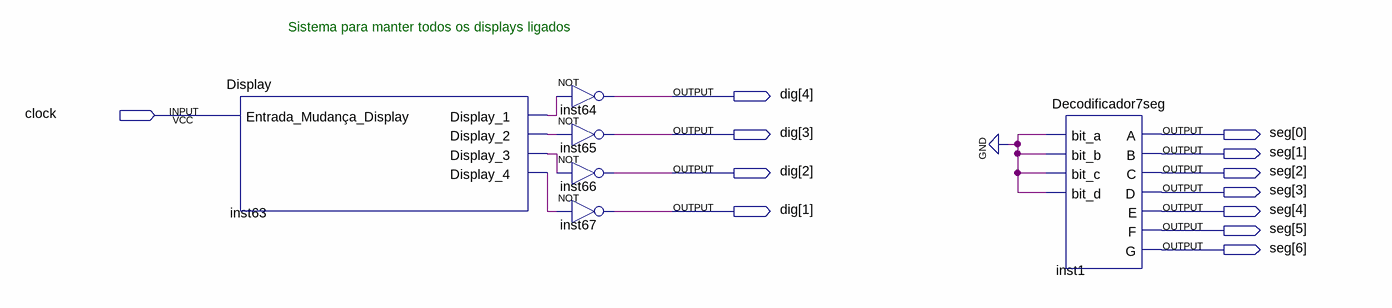
[diagram p0: schematic sheet]
// Quartus schematic Ligar4Displays.bdf as structural Verilog: 6 symbols, 12 pins
module Ligar4Displays (
  input  clock,
  output [4:1] dig,
  output [6:0] seg
);

  wire inst63_display_1, inst63_display_2, inst63_display_3, inst63_display_4;

  Display inst63 (
    .\Entrada_Mudança_Display (clock), .Display_1(inst63_display_1), .Display_2(inst63_display_2),
    .Display_3(inst63_display_3), .Display_4(inst63_display_4));
  not inst64 (dig[4], inst63_display_1);
  not inst65 (dig[3], inst63_display_2);
  not inst66 (dig[2], inst63_display_3);
  not inst67 (dig[1], inst63_display_4);
  Decodificador7seg inst1 (
    .bit_a(1'b0), .bit_b(1'b0), .bit_c(1'b0), .bit_d(1'b0), .A(seg[0]), .B(seg[1]), .C(seg[2]), .D(seg[3]),
    .E(seg[4]), .F(seg[5]), .G(seg[6]));

  // Notes on the sheet:
  //   Sistema para manter todos os displays ligados
endmodule
